# Altium schematic sheet STM32G070_prototype.SchDoc
size A4; SheetNumber: 1; SheetTotal: 1
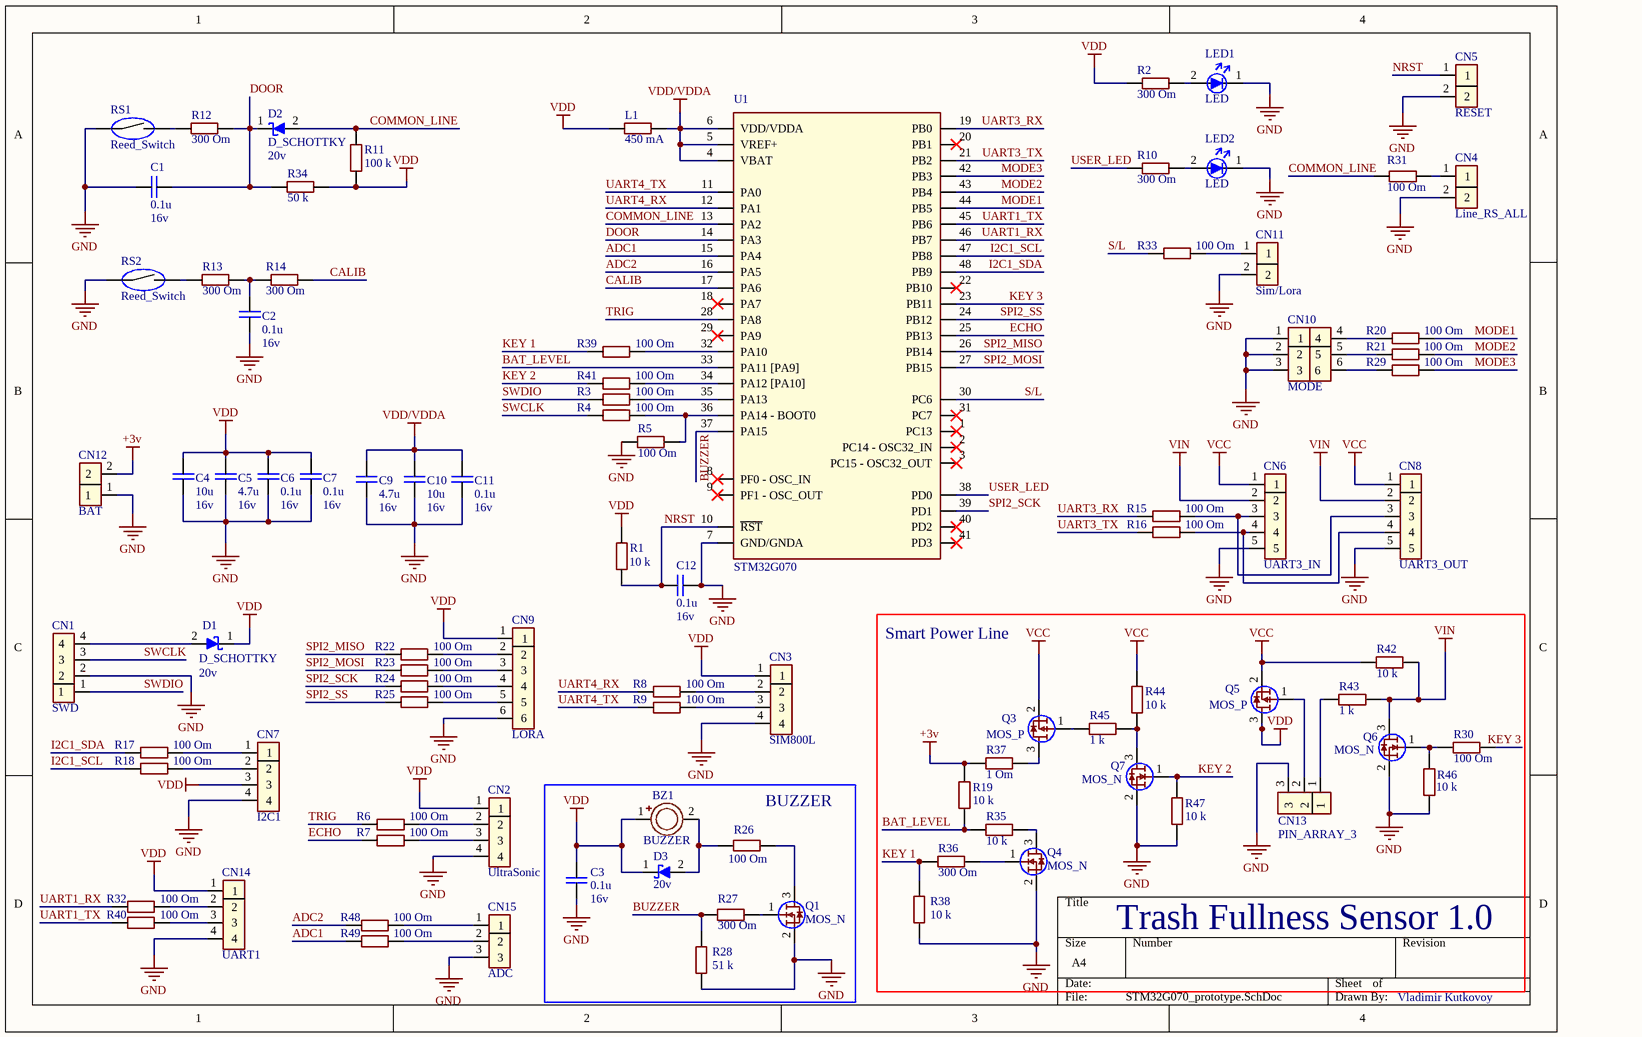
[diagram p0: STM32G070_prototype.SchDoc]

## Parts
BZ1  BUZZER  [BUZZER]
C1  Сapacity: 0.1u  Voltage: 16v  [CAPC06003]  (hidden comment: Capacitor)
C2  Сapacity: 0.1u  Voltage: 16v  [CAP_0603]  (hidden comment: Capacitor)
C3  Сapacity: 0.1u  Voltage: 16v  [CAP_0603]  (hidden comment: Capacitor)
C4  Сapacity: 10u  Voltage: 16v  [CAPC06003]
C5  Сapacity: 4.7u  Voltage: 16v  [CAPC06003]  (hidden comment: Capacitor)
C6  Сapacity: 0.1u  Voltage: 16v  [CAPC06003]  (hidden comment: Capacitor)
C7  Сapacity: 0.1u  Voltage: 16v  [CAPC06003]  (hidden comment: Capacitor)
C9  Сapacity: 4.7u  Voltage: 16v  [Cap_0603]  (hidden comment: Capacitor)
C10  Сapacity: 10u  Voltage: 16v  [CAP_0603]  (hidden comment: Capacitor)
C11  Сapacity: 0.1u  Voltage: 16v  [Cap_0603]  (hidden comment: Capacitor)
C12  Сapacity: 0.1u  Voltage: 16v  [CAPC06003]  (hidden comment: Capacitor)
CN1  SWD  [PIN_2.54_4_array]
CN2  UltraSonic  [PIN_2.54_4_array]
CN3  SIM800L  [PIN_2.54_4_array]
CN4  Line_RS_ALL  [PIN_2.54_2_ARRAY]
CN5  RESET  [PIN_2.54_2_ARRAY]
CN6  UART3_IN  [Pin_2.54_5_Array]
CN7  I2C1  [PIN_2.54_4_array]
CN8  UART3_OUT  [Pin_2.54_5_Array]
CN9  LORA  [Pin_2.54_6_Array]
CN10  MODE  [Pin_2.54_3x2_Array]
CN11  Sim/Lora  [PIN_2.54_2_ARRAY]
CN12  BAT  [PIN_2.54_2_ARRAY]
CN13  PIN_ARRAY_3  [Pin_2.54_3_Array]
CN14  UART1  [PIN_2.54_4_array]
CN15  ADC  [Pin_2.54_3_Array]
D1  D_SCHOTTKY  Voltage: 20v  [Diod_Shottky]
D2  D_SCHOTTKY  Voltage: 20v  [Diod_Shottky]
D3  Voltage: 20v  [Diod_Shottky]  (hidden comment: D_SCHOTTKY)
L1  450 mA  [RES_0603]
LED1  LED  [Led_0603_Red]
LED2  LED  [Led_0603_Red]
Q1  MOS_N  [SOT23-3]
Q3  MOS_P  [SOT23-3]
Q4  MOS_N  [SOT23-3]
Q5  MOS_P  [SOT23-3]
Q6  MOS_N  [SOT23-3]
Q7  MOS_N  [SOT23-3]
R1  10 k  [RES_0603]
R2  300 Om  [RES_0603]
R3  100 Om  [RES_0603]
R4  100 Om  [RES_0603]
R5  100 Om  [RES_0603]
R6  100 Om  [RES_0603]
R7  100 Om  [RES_0603]
R8  100 Om  [RES_0603]
R9  100 Om  [RES_0603]
R10  300 Om  [RES_0603]
R11  100 k  [RES_0603]
R12  300 Om  [RES_0603]
R13  300 Om  [RES_0603]
R14  300 Om  [RES_0603]
R15  100 Om  [RES_0603]
R16  100 Om  [RES_0603]
R17  100 Om  [RES_0603]
R18  100 Om  [RES_0603]
R19  10 k  [RES_0603]
R20  100 Om  [RES_0603]
R21  100 Om  [RES_0603]
R22  100 Om  [RES_0603]
R23  100 Om  [RES_0603]
R24  100 Om  [RES_0603]
R25  100 Om  [RES_0603]
R26  100 Om  [RES_0603]
R27  300 Om  [RES_0603]
R28  51 k  [RES_0603]
R29  100 Om  [RES_0603]
R30  100 Om  [RES_0603]
R31  100 Om  [RES_0603]
R32  100 Om  [RES_0603]
R33  100 Om  [RES_0603]
R34  50 k  [RES_0603]
R35  10 k  [RES_0603]
R36  300 Om  [RES_0603]
R37  1 Om  [Res_0805]
R38  10 k  [RES_0603]
R39  100 Om  [RES_0603]
R40  100 Om  [RES_0603]
R41  100 Om  [RES_0603]
R42  10 k  [RES_0603]
R43  1 k  [RES_0603]
R44  10 k  [RES_0603]
R45  1 k  [RES_0603]
R46  10 k  [RES_0603]
R47  10 k  [RES_0603]
R48  100 Om  [RES_0603]
R49  100 Om  [RES_0603]
RS1  Reed_Switch  [PIN_2.54_2_ARRAY]
RS2  Reed_Switch  [PIN_2.54_2_ARRAY]
U1  STM32G070  [LQFP48]

## Blocks framed on the sheet
Trash Fullness Sensor 1.0: CN13 Q3-Q7 R19 R30 R35-R38 R42-R47
BUZZER: BZ1 C3 D3 Q1 R26-R28

## Nets
+3v: CN12.2 R19.2 R37.1
GND: C1.2 C2.1 C3.1 C4.1 C5.1 C6.1 C7.1 C9.1 C10.1 C11.1 C12.1 CN1.2 CN2.4 CN3.4 CN4.2 CN5.2 CN6.5 CN7.4 CN8.5 CN9.6 CN10.1 CN10.2 CN10.3 CN11.2 CN12.1 CN13.3 CN14.4 CN15.3 LED1.1 LED2.1 Q1.2(S) Q4.2(S) Q6.2(S) Q7.2(S) R5.1 R28.1 R38.1 R46.1 R47.2 RS1.1 RS2.1 U1.7(GND/GNDA)
VCC: CN6.1 CN8.1 Q3.2(S) Q5.2(S) R42.1 R44.1
VDD: BZ1.1 C3.2 C4.2 C5.2 C6.2 C7.2 CN2.1 CN3.1 CN7.3 CN9.1 CN14.1 D1.1 D3.1 L1.1 Q5.3(D) R1.2 R2.1 R11.1 R34.2
VDD/VDDA: C9.2 C10.2 C11.2 L1.2 U1.4(VBAT) U1.5(VREF+) U1.6(VDD/VDDA)
VIN: CN6.2 CN8.2 Q6.3(D) R42.2 R43.2
ADC1: R49.1 U1.15(PA4)
ADC2: R48.1 U1.16(PA5)
BAT_LEVEL: R19.1 R35.2 U1.33(PA11_[PA9])
BUZZER: R27.1 R28.2 U1.37(PA15)
CALIB: R14.2 U1.17(PA6)
COMMON_LINE: D2.2 R11.2 R31.1 U1.13(PA2)
DOOR: C1.1 D2.1 R12.1 R34.1 U1.14(PA3)
ECHO: R7.1 U1.25(PB13)
I2C1_SCL: R18.1 U1.47(PB8)
I2C1_SDA: R17.1 U1.48(PB9)
KEY 1: R36.1 R38.2 R39.1
KEY 2: Q7.1(G) R41.1 R47.1
KEY 3: R30.1 U1.23(PB11)
MODE1: R20.2 U1.44(PB5)
MODE2: R21.2 U1.43(PB4)
MODE3: R29.2 U1.42(PB3)
NRST: C12.2 CN5.1 R1.1 U1.10(~{RST})
S/L: R33.1 U1.30(PС6)
SPI2_MISO: R22.1 U1.26(PB14)
SPI2_MOSI: R23.1 U1.27(PB15)
SPI2_SCK: R24.1 U1.39(PD1)
SPI2_SS: R25.1 U1.24(PB12)
SWCLK: CN1.3 R4.1
SWDIO: CN1.1 R3.1
TRIG: R6.1 U1.28(PA8)
UART1_RX: R32.1 U1.46(PB7)
UART1_TX: R40.1 U1.45(PB6)
UART3_RX: R15.1 U1.19(PB0)
UART3_TX: R16.1 U1.21(PB2)
UART4_RX: R8.1 U1.12(PA1)
UART4_TX: R9.1 U1.11(PA0)
USER_LED: R10.1 U1.38(PD0)
NetBZ1_2: BZ1.2 D3.2 R26.1
NetC2_2: C2.2 R13.1 R14.1
NetCN1_4: CN1.4 D1.2
NetCN2_2: CN2.2 R6.2
NetCN2_3: CN2.3 R7.2
NetCN3_2: CN3.2 R8.2
NetCN3_3: CN3.3 R9.2
NetCN4_1: CN4.1 R31.2
NetCN6_3: CN6.3 CN8.3 R15.2
NetCN6_4: CN6.4 CN8.4 R16.2
NetCN7_1: CN7.1 R17.2
NetCN7_2: CN7.2 R18.2
NetCN9_2: CN9.2 R22.2
NetCN9_3: CN9.3 R23.2
NetCN9_4: CN9.4 R24.2
NetCN9_5: CN9.5 R25.2
NetCN10_4: CN10.4 R20.1
NetCN10_5: CN10.5 R21.1
NetCN10_6: CN10.6 R29.1
NetCN11_1: CN11.1 R33.2
NetCN13_1: CN13.1 R43.1
NetCN13_2: CN13.2 Q5.1(G)
NetCN14_2: CN14.2 R32.2
NetCN14_3: CN14.3 R40.2
NetCN15_1: CN15.1 R48.2
NetCN15_2: CN15.2 R49.2
NetLED1_2: LED1.2 R2.2
NetLED2_2: LED2.2 R10.2
NetQ1_1: Q1.1(G) R27.2
NetQ1_3: Q1.3(D) R26.2
NetQ3_1: Q3.1(G) R45.1
NetQ3_3: Q3.3(D) R37.2
NetQ4_1: Q4.1(G) R36.2
NetQ4_3: Q4.3(D) R35.1
NetQ6_1: Q6.1(G) R30.2 R46.2
NetQ7_3: Q7.3(D) R44.2 R45.2
NetR3_2: R3.2 U1.35(PA13)
NetR4_2: R4.2 R5.2 U1.36(PA14_-_BOOT0)
NetR12_2: R12.2 RS1.2
NetR13_2: R13.2 RS2.2
NetR39_2: R39.2 U1.32(PA10)
NetR41_2: R41.2 U1.34(PA12_[PA10])

Not connected (* = marked no-connect by the designer): U1 1(PС13)* 2(PC14_-_OSC32_IN)* 3(PC15_-_OSC32_OUT)* 8(PF0_-_OSC_IN)* 9(PF1_-_OSC_OUT)* 18(PA7)* 20(PB1)* 22(PB10)* 29(PA9)* 31(PС7)* 40(PD2)* 41(PD3)*

## Notes on the sheet
- Smart Power Line
- Vladimir Kutkovoy

## Library data of the parts
C4 = Capacitor
CN1-CN3 CN7 CN14 = PIN_ARRAY_4
CN4 CN5 CN11 CN12 = PIN_ARRAY_2
CN6 CN8 = PIN_ARRAY_5
CN9 = PIN_ARRAY_6
CN10 = PIN_ARRAY_3x2
CN15 = PIN_ARRAY_3
D1-D3 = Diod_Shottky
L1 = Filter: BLM18BB221SN1D
R1-R49 = Resistor